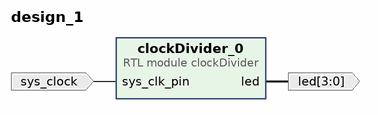
[diagram p0: block diagram of the top level]
# Vivado block design design_1, xc7z010clg400-1, Vivado 2019.1.1
create_bd_design design_1

create_bd_port -dir I -type clk sys_clock
set_property -dict {CONFIG.FREQ_HZ 125000000} [get_bd_ports sys_clock]
create_bd_port -dir O -from 3 -to 0 led

create_bd_cell -type module -reference clockDivider clockDivider_0

# ---- connections ----

connect_bd_net [get_bd_ports sys_clock] [get_bd_pins clockDivider_0/sys_clk_pin]
connect_bd_net [get_bd_pins clockDivider_0/led] [get_bd_ports led]

validate_bd_design
save_bd_design
